# Altium schematic sheet sheet_solider.SchDoc
size A; SheetNumber: 2; SheetTotal: 3
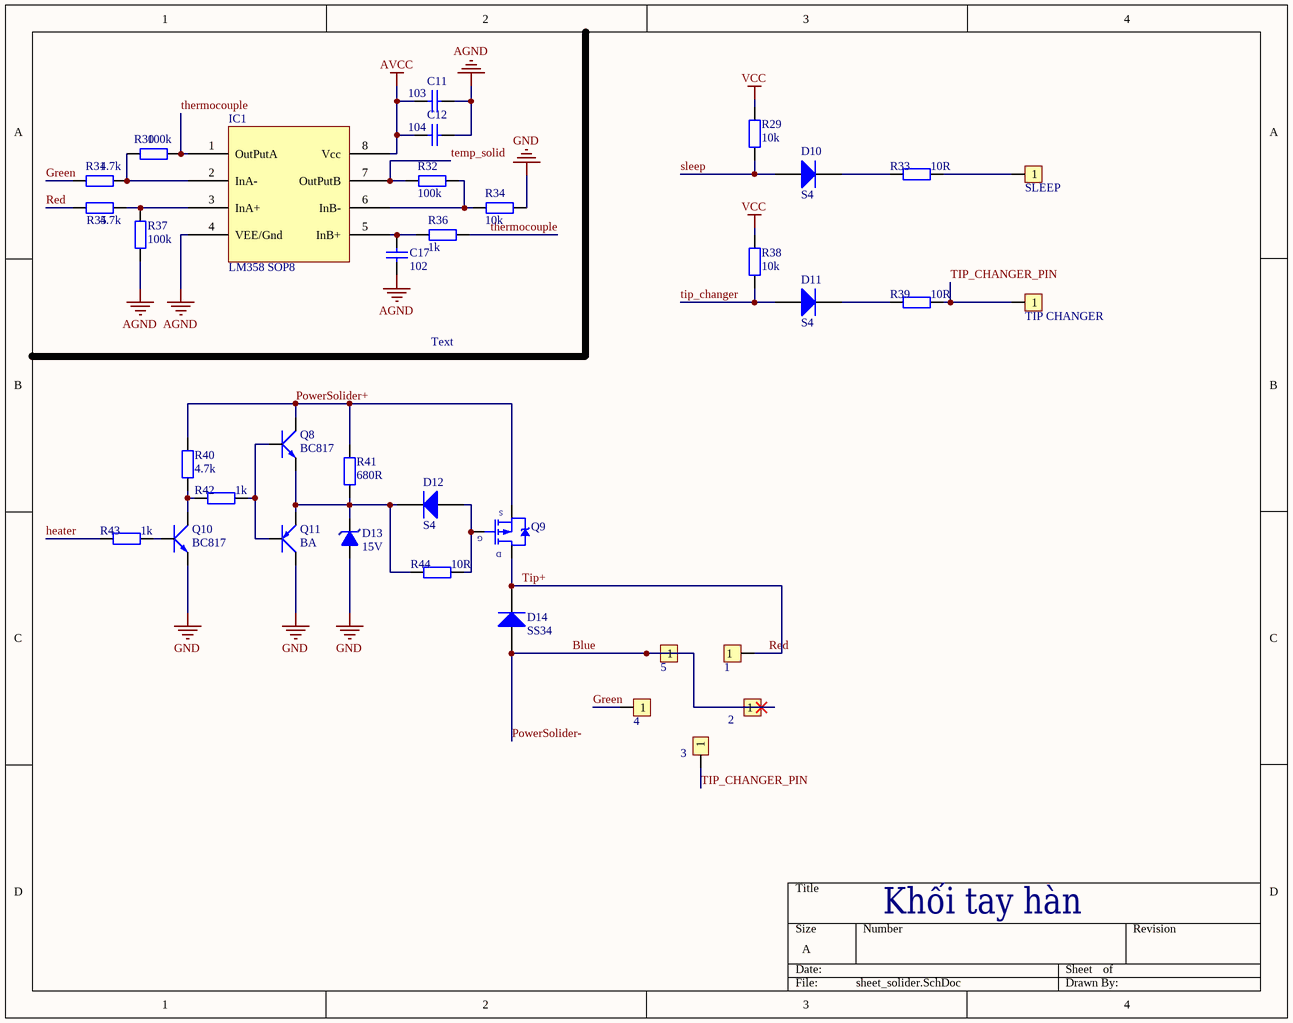
[diagram p0: sheet_solider.SchDoc]

## Parts
C11  103  [tu 0603]
C12  104  [tu 0603]
C17  102  [tu 0603]
D10  S4  [DIODE SOD-123]
D11  S4  [DIODE SOD-123]
D12  S4  [DIODE SOD-123]
D13  15V  [DIODE ZENNER SMD SOD80]
D14  SS34  [DIODE SMA]
IC1  LM358 SOP8  [SOP 8]
JP3  SLEEP  [JP 1x1 DT]
JP4  TIP CHANGER  [JP 1x1 DT]
JP5  5  [JP 1x1 DT]
JP6  1  [JP 1x1 DT]
JP7  4  [JP 1x1 DT]
JP8  2  [JP 1x1 DT]
JP9  3  [JP 1x1 DT]
Q8  BC817  [SOT-23]
Q9  IRF4905S  [D2PACK]  (value not drawn)
Q10  BC817  [SOT-23]
Q11  BA  [SOT23]
R29  10k  [Tro smd 0603]
R30  100k  [Tro smd 0603]
R31  4.7k  [Tro smd 0603]
R32  100k  [Tro smd 0603]
R33  10R  [Tro smd 0603]
R34  10k  [Tro smd 0603]
R35  4.7k  [Tro smd 0603]
R36  1k  [Tro smd 0603]
R37  100k  [Tro smd 0603]
R38  10k  [Tro smd 0603]
R39  10R  [Tro smd 0603]
R40  4.7k  [Tro smd 0603]
R41  680R  [tro vach 1/4w]
R42  1k  [Tro smd 0603]
R43  1k  [Tro smd 0603]
R44  10R  [Tro smd 0603]

## Nets
AGND: C11.2 C12.2 C17.1 IC1.4(VEE/Gnd) R37.2
AVCC: C11.1 C12.1 IC1.8(Vcc)
GND: D13.1(A) Q10.2(E) Q11.3(C) R34.2
VCC: R29.2 R38.2
Blue: D14.1(A) JP5.1 JP8.1  [also labelled PowerSolider-]
Green: JP7.1 R31.2
heater: R43.1
PowerSolider+: Q8.3(C) Q9.3(S) R40.2 R41.2
Red: D14.2(K) JP6.1 Q9.2(D) R35.2  [also labelled Tip+]
sleep: D10.1(A) R29.1
temp_solid: IC1.7(OutPutB) R32.1
thermocouple: IC1.1(OutPutA) R30.2 R36.1
tip_changer: D11.1(A) R38.1
TIP_CHANGER_PIN: JP4.1 JP9.1 R39.2
NetC17_2: C17.2 IC1.5(InB+) R36.2
NetD10_2: D10.2(K) R33.1
NetD11_2: D11.2(K) R39.1
NetD12_1: D12.1(A) Q9.1(G) R44.2
NetD12_2: D12.2(K) D13.2(K) Q8.2(E) Q11.2(E) R41.1 R44.1
NetIC1_2: IC1.2(InA-) R30.1 R31.1
NetIC1_3: IC1.3(InA+) R35.1 R37.1
NetIC1_6: IC1.6(InB-) R32.2 R34.1
NetJP3_1: JP3.1 R33.2
NetQ8_1: Q8.1(B) Q11.1(B) R42.2
NetQ10_1: Q10.1(B) R43.2
NetQ10_3: Q10.3(C) R40.1 R42.1

## Notes on the sheet
- Text
- Khối tay hàn

## Library data of the parts
C11 C12 C17 = Tu 0603 106 16V 20%: Dán; Don_Vi: Con; So_Chan: 2; Ten_Linh_Kien: Tụ 0603-10uF 20% 16V; Ma_Hang: MH004848; Chung_Loai: Dán; Kieu_Chan: *
D10-D12 = Diode S4: Dán; Ten_Linh_Kien: Diode S4 SOD123 ( 1N5819 SOD123); Ma_Hang: MH005519; Don_Vi: Con; Ghi_Chu: *; Chung_Loai: Dán; Kieu_Chan: *
D13 = Diode Zener 15V: Dán; Don_Vi: Con; Ma_Hang: MH002883; Ten_Linh_Kien: Diode Zener 1/2W 15V SMD1206 ZMM15; Ghi_Chu: *; Chung_Loai: Dán; Kieu_Chan: *
D14 = Diode SS34 ( 1N5822 ): Dán; Don_Vi: Con; Ma_Hang: MH002104; Ten_Linh_Kien: Diode SS34 3A 40V SMA ( 1N5822 SS34A); Kieu_Chan: *; Chung_Loai: Dán
IC1 = LM358 SOP8: Dán; Ma_Hang: MH000609; Don_Vi: Con; Ten_Linh_Kien: LM358 SOP8; Kieu_Chan: *; Ghi_Chu: *; Chung_Loai: Dán
JP3-JP9 = JP 1x1 2.54 Duc Cong: Cắm; Ten_Linh_Kien: Jump Đơn Đực 2.54MM 1x40P Cong Đứng; Don_Vi: Con; Ma_Hang: MH000904; Ghi_Chu: *; Kieu_Chan: *; Chung_Loai: Cắm
Q8 Q10 = Trans BC817: SOT-23 - C8658; Value: C9014
Q9 = IRF4905S: 55V 75A
Q11 = Trans A1015 BA SMD: PNP 600mW, ECB
R29-R40 R42-R44 = Tro 0603 5% 10R: Dán; So_Chan: 2; Ten_Linh_Kien: Trở 0603 5% 10R; Ma_Hang: MH006317; Don_Vi: Con; Chung_Loai: Dán; Kieu_Chan: *
R41 = Tro Vach 1/4W 5% 680R: Cắm; Don _Vi: Con; So_Chan: 2; Ten_Linh_Kien: Trở Vạch 1/4w 5% 680R; Ma_Hang: MH007331; Chung_Loai: Cắm; Kieu_Chan: *